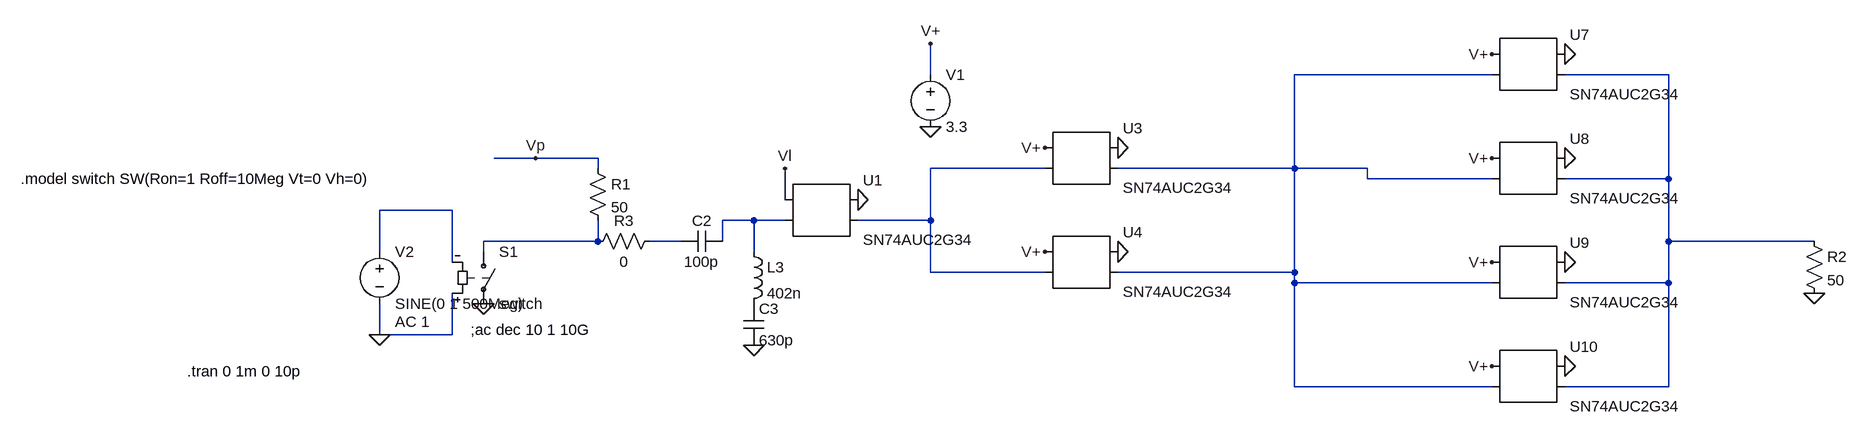
[diagram p0: schematic Draft1.asc]
Draft1.asc, the LTspice schematic file:
Version 4
SHEET 1 2024 680
WIRE 608 -304 608 -352
WIRE 1472 -304 1168 -304
WIRE 1744 -304 1584 -304
WIRE 0 -176 -64 -176
WIRE 96 -176 0 -176
WIRE 96 -160 96 -176
WIRE 784 -160 608 -160
WIRE 1168 -160 1168 -304
WIRE 1168 -160 896 -160
WIRE 1280 -160 1168 -160
WIRE 1280 -144 1280 -160
WIRE 1472 -144 1280 -144
WIRE 1744 -144 1744 -304
WIRE 1744 -144 1584 -144
WIRE 384 -112 384 -160
WIRE -128 -96 -240 -96
WIRE 336 -80 288 -80
WIRE 384 -80 336 -80
WIRE 608 -80 608 -160
WIRE 608 -80 496 -80
WIRE 96 -48 96 -80
WIRE 96 -48 -80 -48
WIRE 224 -48 176 -48
WIRE 288 -48 288 -80
WIRE 1744 -48 1744 -144
WIRE 1968 -48 1744 -48
WIRE -240 -32 -240 -96
WIRE -80 -32 -80 -48
WIRE 336 -32 336 -80
WIRE -128 -16 -128 -96
WIRE 608 0 608 -80
WIRE 784 0 608 0
WIRE 1168 0 1168 -160
WIRE 1168 0 896 0
WIRE 1168 16 1168 0
WIRE 1472 16 1168 16
WIRE 1744 16 1744 -48
WIRE 1744 16 1584 16
WIRE -240 96 -240 48
WIRE -128 96 -128 32
WIRE -128 96 -240 96
WIRE 1168 176 1168 16
WIRE 1472 176 1168 176
WIRE 1744 176 1744 16
WIRE 1744 176 1584 176
FLAG 608 -224 0
FLAG 608 -352 V+
FLAG -80 48 0
FLAG -240 96 0
FLAG 0 -176 Vp
FLAG 384 -160 Vl
FLAG 496 -112 0
FLAG 336 112 0
FLAG 784 -192 V+
FLAG 784 -32 V+
FLAG 896 -192 0
FLAG 896 -32 0
FLAG 1472 -336 V+
FLAG 1472 -176 V+
FLAG 1584 -336 0
FLAG 1584 -176 0
FLAG 1472 -16 V+
FLAG 1472 144 V+
FLAG 1584 -16 0
FLAG 1584 144 0
FLAG 1968 32 0
SYMBOL voltage 608 -320 R0
WINDOW 123 0 0 Left 0
WINDOW 39 0 0 Left 0
SYMATTR InstName V1
SYMATTR Value 3.3
SYMBOL sw -80 -48 R0
SYMATTR InstName S1
SYMATTR Value switch
SYMBOL voltage -240 -48 R0
WINDOW 123 24 124 Left 2
WINDOW 39 0 0 Left 0
SYMATTR InstName V2
SYMATTR Value SINE(0 1 500Meg)
SYMATTR Value2 AC 1
SYMBOL AutoGenerated\\SN74AUC2G34 432 -96 R0
SYMATTR InstName U1
SYMBOL ind 320 -48 R0
SYMATTR InstName L3
SYMATTR Value 402n
SYMBOL cap 288 -64 R90
WINDOW 0 0 32 VBottom 2
WINDOW 3 32 32 VTop 2
SYMATTR InstName C2
SYMATTR Value 100p
SYMBOL cap 320 48 R0
SYMATTR InstName C3
SYMATTR Value 630p
SYMBOL res 80 -176 R0
SYMATTR InstName R1
SYMATTR Value 50
SYMBOL res 192 -64 R90
WINDOW 0 0 56 VBottom 2
WINDOW 3 32 56 VTop 2
SYMATTR InstName R3
SYMATTR Value 0
SYMBOL AutoGenerated\\SN74AUC2G34 832 -176 R0
SYMATTR InstName U3
SYMBOL AutoGenerated\\SN74AUC2G34 832 -16 R0
SYMATTR InstName U4
SYMBOL AutoGenerated\\SN74AUC2G34 1520 -320 R0
SYMATTR InstName U7
SYMBOL AutoGenerated\\SN74AUC2G34 1520 -160 R0
SYMATTR InstName U8
SYMBOL AutoGenerated\\SN74AUC2G34 1520 0 R0
SYMATTR InstName U9
SYMBOL AutoGenerated\\SN74AUC2G34 1520 160 R0
SYMATTR InstName U10
SYMBOL res 1952 -64 R0
SYMATTR InstName R2
SYMATTR Value 50
TEXT -100 88 Left 2 !;ac dec 10 1 10G
TEXT -792 -144 Left 2 !.model switch SW(Ron=1 Roff=10Meg Vt=0 Vh=0)
TEXT -536 152 Left 2 !.tran 0 1m 0 10p

The netlist it stands for:
* Draft1.asc
V1 V+ 0 3.3
S1 N006 0 0 N004 switch
V2 N004 0 SINE(0 1 500Meg) AC 1
* U1: SN74AUC2G34 (symbol AutoGenerated\SN74AUC2G34 not available, pins judged from their places): pin1=Vl pin2=N005 pin3=0 pin4=N003
L3 N005 P001 402n
C2 N005 N007 100p
C3 P001 0 630p
R1 Vp N006 50
R3 N007 N006 0
* U3: SN74AUC2G34 (symbol AutoGenerated\SN74AUC2G34 not available, pins judged from their places): pin1=V+ pin2=N003 pin3=0 pin4=N001
* U4: SN74AUC2G34 (symbol AutoGenerated\SN74AUC2G34 not available, pins judged from their places): pin1=V+ pin2=N003 pin3=0 pin4=N001
* U7: SN74AUC2G34 (symbol AutoGenerated\SN74AUC2G34 not available, pins judged from their places): pin1=V+ pin2=N001 pin3=0 pin4=N002
* U8: SN74AUC2G34 (symbol AutoGenerated\SN74AUC2G34 not available, pins judged from their places): pin1=V+ pin2=N001 pin3=0 pin4=N002
* U9: SN74AUC2G34 (symbol AutoGenerated\SN74AUC2G34 not available, pins judged from their places): pin1=V+ pin2=N001 pin3=0 pin4=N002
* U10: SN74AUC2G34 (symbol AutoGenerated\SN74AUC2G34 not available, pins judged from their places): pin1=V+ pin2=N001 pin3=0 pin4=N002
R2 N002 0 50
;ac dec 10 1 10G
.model switch SW(Ron=1 Roff=10Meg Vt=0 Vh=0)
.tran 0 1m 0 10p
.backanno
.end